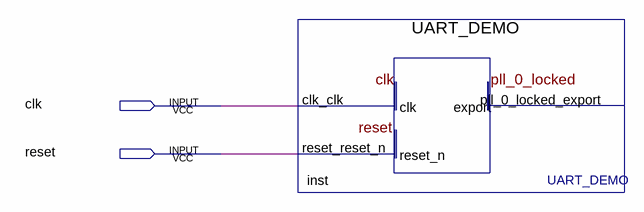
[diagram p0: schematic sheet]
// Quartus schematic UART_DEMO_TOP.bdf as structural Verilog: 1 symbols, 2 pins
module UART_DEMO_TOP (
  input  clk,
  input  reset
);

  UART_DEMO inst (.clk_clk(clk), .reset_reset_n(reset));  // open: pll_0_locked_export
endmodule
